# EAGLE design BackscatterPlantSensor_v1 (EAGLE 6.4)

## Sheet 1 of 3
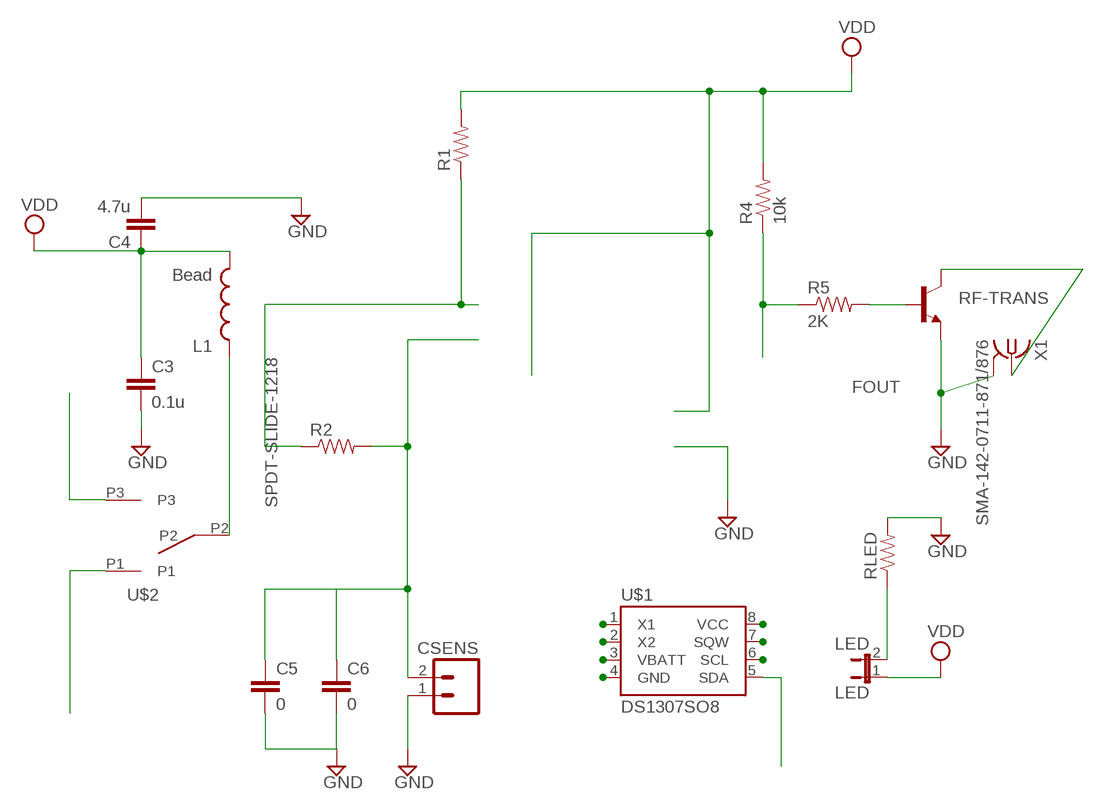
[diagram p0: schematic, sheet 1]

### Parts
C3  0.1u  CAP0603-CAP  [0603-CAP]
C4  4.7u  CAP0805  [0805]
C5  0  CAP0603-CAP  [0603-CAP]
C6  0  CAP0603-CAP  [0603-CAP]
CSENS  M02PTH  [1X02]
L1  Bead  INDUCTOR0402  [C0402]
LED  LED  JUMPER-2PTH_LOCK  [1X02_LOCK]
R1  RESISTOR0805-RES  [0805]
R2  RESISTOR0603-RES  [0603-RES]
R4  10k  RESISTOR0805-RES  [0805]
R5  2K  RESISTOR0805-RES  [0805]
RF-TRANS  TRANSISTOR_NPNSOT23  [SOT23]
RLED  RESISTOR0805-RES  [0805]
U$1  DS1307SO8  [SO08]
U$2  SPDT-SLIDE-1218  [SPDT-SLIDE-1218]
X1  SMA-142-0711-871/876  [J502-ND-142-0711-871/876]

### Nets
DGND: C3.2 C4.2 C5.2 C6.2 CSENS.1 RF-TRANS.2(E) RLED.2 U$1.1(X1) X1.G@1(GND) ; supply symbol labelled GND
FOUT: R4.1 R5.1 U$1.3(VBATT)
N$4: LED.2 RLED.1
N$5: RF-TRANS.3(C) X1.1
N$7: U$2.P3
N$9: R5.2 RF-TRANS.1(B)
P2: C5.1 C6.1 CSENS.2 R2.2 U$1.2(X2) U$1.6(SCL)
P5: U$1.5(SDA) ; also sheet 2
P7: R1.1 R2.1 U$1.7(SQW)
POWER: U$2.P1 ; also sheet 2
POWEROUT: L1.1 U$2.P2 ; also sheet 2
VDD: C3.1 C4.1 L1.2 LED.1 R1.2 R4.2 U$1.4(GND) U$1.8(VCC)

## Sheet 2 of 3
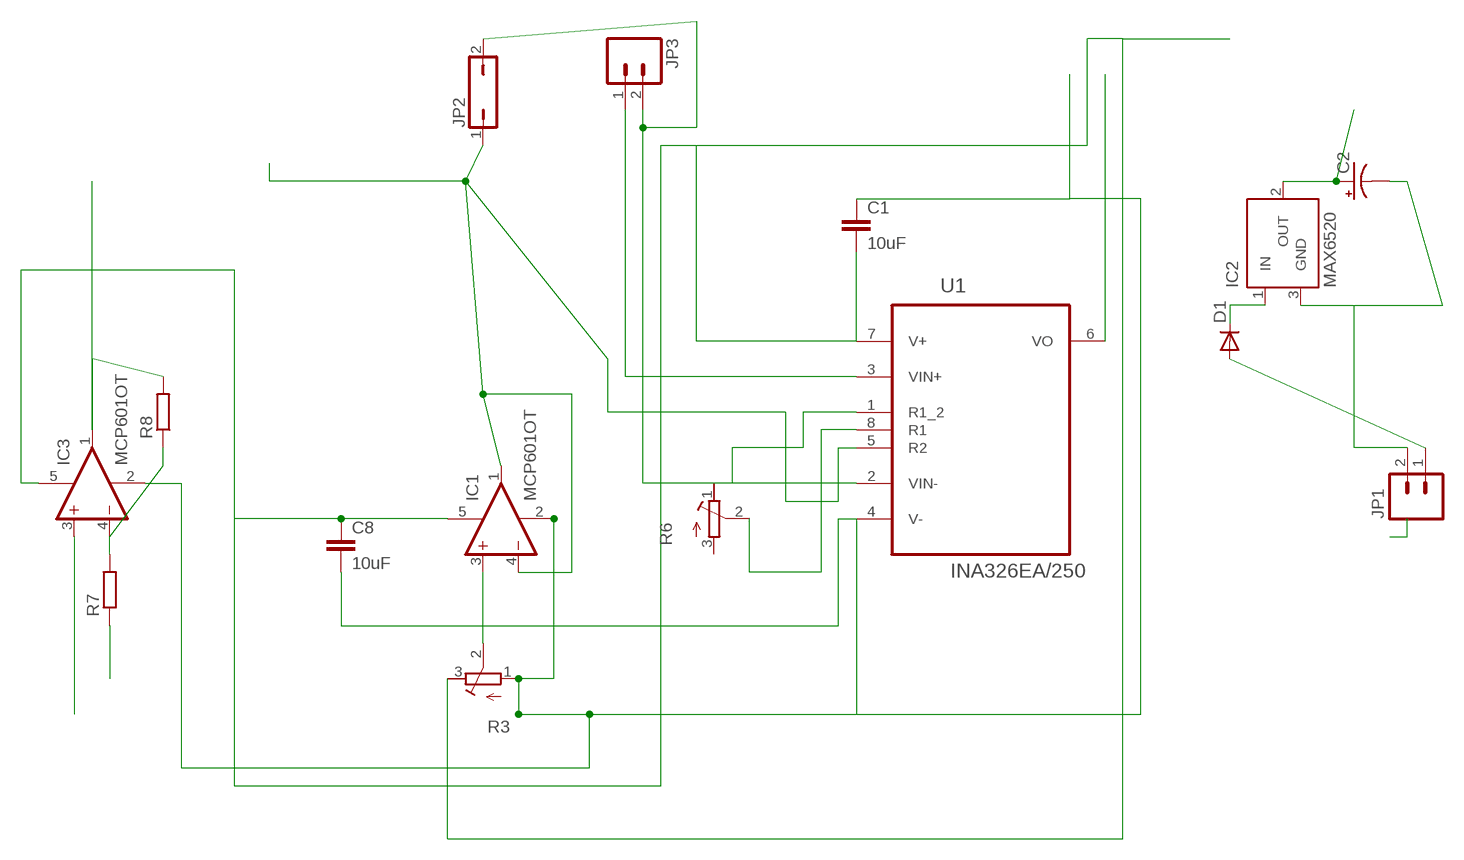
[diagram p1: schematic, sheet 2]

### Parts
C1  10uF  CAP0805  [0805]
C2  CAP_POLPTH1  [CPOL-RADIAL-100UF-25V]
C8  10uF  CAP0805  [0805]
D1  DIODESOD523  [SOD523]
IC1  MCP601OT  [SOT23-5]
IC2  MAX6520  [SOT23]
IC3  MCP601OT  [SOT23-5]
JP1  M02PTH  [1X02]
JP2  JP1Q  [JP1]
JP3  M02PTH  [1X02]
R3  R-TRIMM3314J  [RTRIM3314J]
R6  R-TRIMM3314G  [RTRIM3314G]
R7  R-EU_R0603  [R0603]
R8  R-EU_R0603  [R0603]
U1  INA326EA/250  [SOP65P490X110-8N]

### Nets
AGND: C1.1 C8.2 IC1.2(V-) IC3.2(V-) R3.1(E) R7.1 U1.4(V-)
GND: C2.2(-) IC2.3(GND) JP1.2
IN: D1.C IC2.1(IN)
N$10: IC1.3(+IN) R3.2(S)
N$20: JP2.2 JP3.2 U1.2(VIN-)
N$21: JP3.1 U1.3(VIN+)
N$23: R6.2(S) U1.8(R1)
N$49: R6.1(E) U1.1(R1_2)
N$58: D1.A JP1.1
N$99: IC3.4(-IN) R7.2 R8.1
P5: IC3.1(OUT) R8.2 ; also sheet 1
POWER: C2.1(+) IC2.2(OUT) ; also sheet 1
POWEROUT: C1.2 C8.1 IC1.5(V+) IC3.5(V+) R3.3(A) U1.7(V+) ; also sheet 1
VOUT1: IC3.3(+IN) U1.6(VO)
VREF: IC1.1(OUT) IC1.4(-IN) JP2.1 U1.5(R2)
Unconnected: R6.3(A)

## Sheet 3 of 3

## Power pins joined to a net without a drawn wire
DGND: X1.G@2(GND) X1.G@3(GND) X1.G@4(GND)

## Library data of the parts
C1 C8 = SparkFun-Passives:CAP: Capacitor Standard 0603 ceramic capacitor, and 0.1" leaded capacitor.
C2 = SparkFun:CAP_POL: Capacitor Polarized These are standard SMD and PTH capacitors. Normally 10uF, 47uF, and 100uF in electrolytic and tantalum varieties. Always verify the external diameter of the through hole cap, it varies with capacity, voltage, and manufacturer. The EIA devices should be standard.
C3-C6 = SparkFun-Capacitors:CAP: Capacitor Standard 0603 ceramic capacitor, and 0.1" leaded capacitor.
CSENS = SparkFun:M02: Header 2 Standard 2-pin 0.1" header. Use with straight break away headers (SKU : PRT-00116), right angle break away headers (PRT-00553), swiss pins (PRT-00743), machine pins (PRT-00117), and female headers (PRT-00115). Molex polarized connector foot print use with SKU : PRT-08233 with associated crimp pins and housings.
D1 = SparkFun-DiscreteSemi:DIODE: Diode These are standard reverse protection diodes and small signal diodes. SMA package can handle up to about 1A. SOD-323 can handle about 200mA. What the SOD-323 package when ordering, there are some mfgs out there that are 5-pin packages.
IC1 IC3 = linear:MCP601: Single Op Amp 2.7V to 6.0V Single Supply CMOS Source: http://ww1.microchip.com/downloads/en/DeviceDoc/21314g.pdf
IC2 = maxim:MAX6520: 1.2V Voltage Reference 50ppm/°C, SOT23, 3-Terminal Source: Data sheet <http://datasheets.maxim-ic.com/en/ds/MAX6520.pdf>; MF: MAXIM; MPN: MAX6520EUR-T; OC_FARNELL: unknown; OC_NEWARK: 02J4586
JP1 JP3 = SparkFun-Connectors:M02: Header 2 Standard 2-pin 0.1" header. Use with straight break away headers (SKU : PRT-00116), right angle break away headers (PRT-00553), swiss pins (PRT-00743), machine pins (PRT-00117), and female headers (PRT-00115). Molex polarized connector foot print use with SKU : PRT-08233 with associated crimp pins and housings.
JP2 = jumper:JP1Q: JUMPER
L1 = SparkFun-Passives:INDUCTOR: Inductors Basic Inductor/Choke - 0603 and 1206. Footprints are not proven and vary greatly between part numbers.
LED = SparkFun-Passives:JUMPER-2: Jumper Basic 0.1" spaced jumper. Use with breakaway headers.
R1 R2 R4 R5 RLED = SparkFun-Resistors:RESISTOR: Resistor Basic schematic elements and footprints for 0603, 1206, and PTH resistors.
R3 = resistor:R-TRIMM: Trimm resistor
R6 = rcl:R-TRIMM: Trimm resistor
R7 R8 = resistor:R-EU_: RESISTOR, European symbol
RF-TRANS = SparkFun-DiscreteSemi:TRANSISTOR_NPN: Generic NPN BJT. MMBT2222 is the common NPN we use. Double check against datasheet- not all devices are the same!
U1 = Texas Instruments_By_element14_Batch_1:INA326EA/250: Precision, Rail-to-Rail I/O INSTRUMENTATION AMPLIFIER; MPN: INA326EA/250; OC_FARNELL: 1218192; OC_NEWARK: 74K3817; PACKAGE: MSOP-8; SUPPLIER: Texas Instruments
U$1 = SparkFun-FreqCtrl:DS1307: I2C real-time clock with battery backup.
U$2 = iCube_library:SPDT-SLIDE-1218
X1 = con-coax:SMA-: SMA 50 Ohm End Launch Jack Receptacle - Round Contact Johnson Components Source: www.johnsoncomponents.com .. J502-ND.pdf; MF: JOHNSON COMPONENTS; MPN: 142-0711-871; OC_FARNELL: unknown; OC_NEWARK: 01C1639

## Board
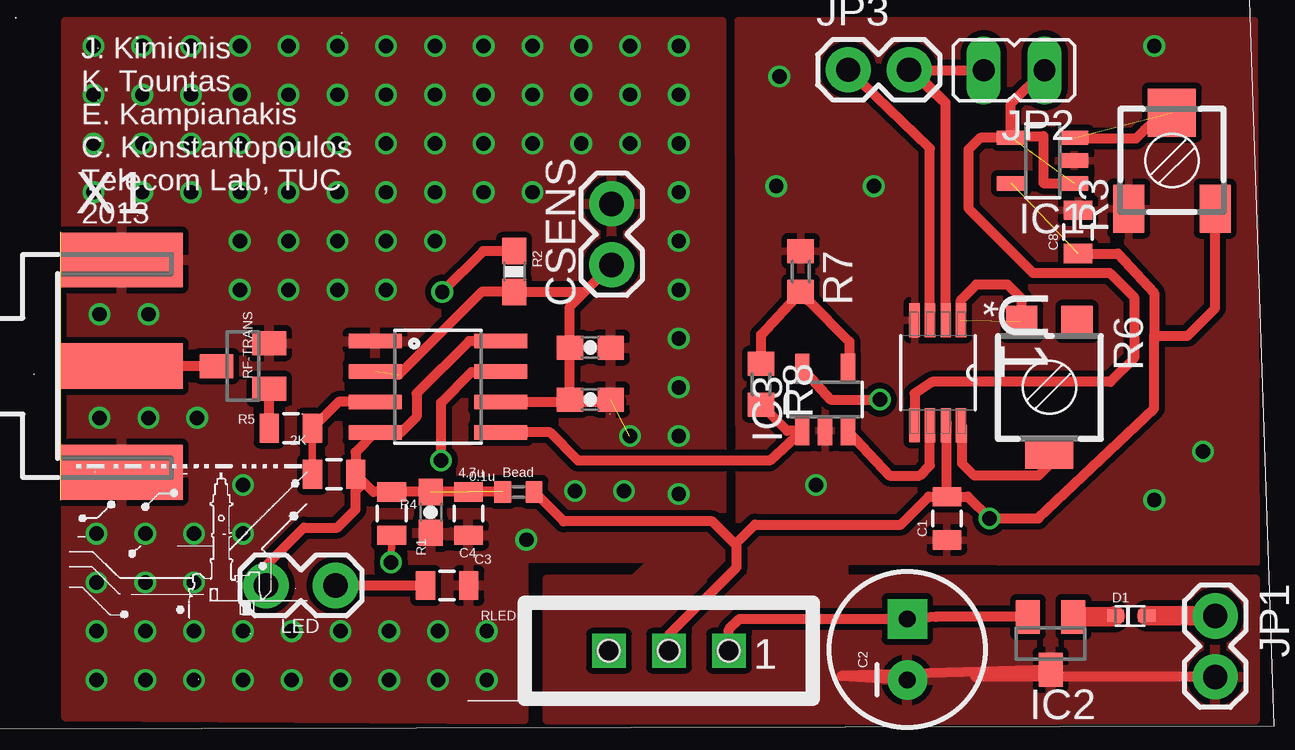
[diagram p2: board, top side]
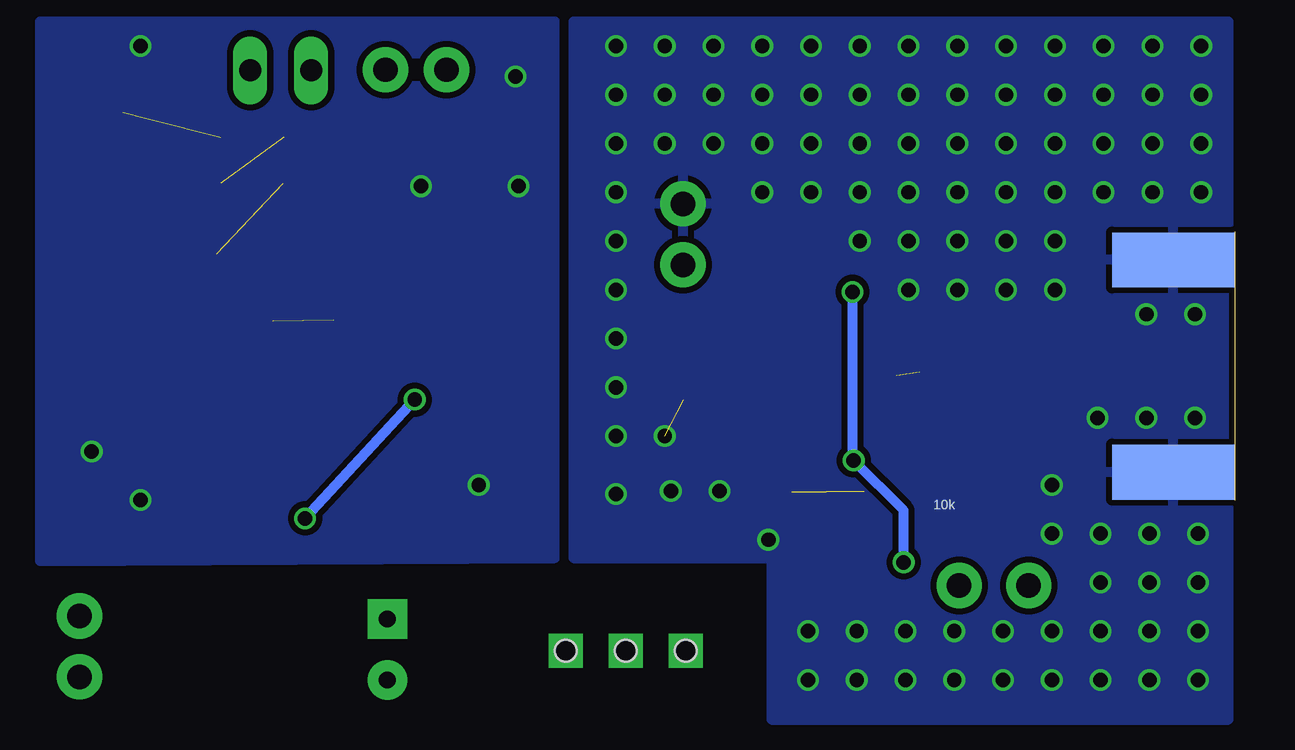
[diagram p3: board, bottom side, seen from below]

Size 0 x 11.18 mm. Coordinates in mm from the lower left corner, seen from the top.
Copper layers (1*16): Top 0.035mm / dielectric 1.5mm / Bottom 0.035mm
Design rules "Fusion_eagle_rule_v1.1 *": minimum track width 6mil, minimum drill 12mil, track to track 10mil, track to pad 10mil, pad to pad 10mil, via to via 10mil, smd to smd 0mil, copper to edge 10mil, drill to drill 10mil, minimum pad ring 10mil, minimum via ring 6mil, stop-mask expansion 2mil, vias tented up to drill 100mil, thermal gap 10mil

### Footprints (pad centres in the part's own frame; a part is rotated, then mirrored left to right if it is on the bottom)
0805 = smd 0.8 x 1.2: 1 -0.9,0; 2 0.9,0
CPOL-RADIAL-100UF-25V = drill 0.7 pad 1.651 square: 1 1.27,0 | drill 0.7 pad 1.651: 2 -1.27,0
0603-CAP = smd 1.1 x 1: 1 -0.85,0; 2 0.85,0
1X02 = drill 1.016 pad 1.88: 1 0,0; 2 2.54,0
SOD523 = smd 0.7 x 0.5: A 0.7,0; C -0.6,0
SOT23-5 = smd 0.6 x 1.2: 1 -0.95,-1.306; 2 0,-1.306; 3 0.95,-1.306; 4 0.95,1.306; 5 -0.95,1.306
SOT23 = smd 1 x 1.4: 1 -0.95,-1.1; 2 0.95,-1.1; 3 0,1.1
JP1 = drill 0.914 long: 1 0,-1.27; 2 0,1.27
C0402 = smd 0.7 x 0.9: 1 -0.65,0; 2 0.65,0
1X02_LOCK = drill 1.016 pad 1.88: 1 -0.178,0; 2 2.718,0
0603-RES = smd 1.1 x 1: 1 -0.85,0; 2 0.85,0
RTRIM3314J = smd 1.3 x 2: 1 -1.8,-2; 3 1.8,-2 | smd 2 x 2: 2 0,2
RTRIM3314G = smd 1.3 x 1.3: 1 1.15,-2.75; 3 -1.15,-2.75 | smd 2 x 1.3: 2 0,2.75
R0603 = smd 1 x 1.1: 1 -0.85,0; 2 0.85,0
SOP65P490X110-8N = smd 1.422 x 0.432: 1 -2.184,0.965; 2 -2.184,0.33; 3 -2.184,-0.33; 4 -2.184,-0.965; 5 2.184,-0.965; 6 2.184,-0.33; 7 2.184,0.33; 8 2.184,0.965
SO08 = smd 0.61 x 2.21: 1 -1.905,-2.616; 2 -0.635,-2.616; 3 0.635,-2.616; 4 1.905,-2.616; 5 1.905,2.616; 6 0.635,2.616; 7 -0.635,2.616; 8 -1.905,2.616
SPDT-SLIDE-1218 = drill 0.9 square: P1 -2.5,0; P2 0,0; P3 2.5,0 | hole 0.9: -2.5,0; 0,0; 2.5,0
J502-ND-142-0711-871/876 = smd 5.08 x 1.905: 1 2.565,0 | smd 5.08 x 2.286: G@1 2.565,4.42; G@2 2.565,-4.42 | smd 5.08 x 2.286 bottom: G@3 2.565,4.42; G@4 2.565,-4.42

### Placement (x,y rotation side)
C1  36.96,-0.76 90 top  (outside the outline)
C2  35.31,-6.22 90 top  (outside the outline)
C3  15.44,-0.51 270 top  (outside the outline)
C4  17.02,-0.56 270 top  (outside the outline)
C5  22.1,6.35 0 top  (outside the outline)
C6  22.1,4.19 0 top  (outside the outline)
C8  42.42,11.18 90 top  (outside the outline)
CSENS  22.99,12.34 270 top  (outside the outline)
D1  44.58,-4.83 0 top  (outside the outline)
IC1  40.94,14.15 90 top  (outside the outline)
IC2  41.27,-5.97 180 top  (outside the outline)
IC3  31.88,4.19 0 top  (outside the outline)
JP1  48.13,-4.83 270 top  (outside the outline)
JP2  39.75,17.91 90 top  (outside the outline)
JP3  32.84,17.93 0 top  (outside the outline)
L1  19.1,0.34 180 top  (outside the outline)
LED  8.76,-3.56 0 top  (outside the outline)
R1  13.82,-0.56 90 top  (outside the outline)
R2  18.92,9.52 270 top  (outside the outline)
R3  46.33,14.15 0 top  (outside the outline)
R4  11.42,1.08 0 top  (outside the outline)
R5  9.62,3 180 top  (outside the outline)
R6  41.22,4.7 180 top  (outside the outline)
R7  30.86,9.52 270 top  (outside the outline)
R8  29.21,4.83 270 top  (outside the outline)
RF-TRANS  7.62,5.59 90 top  (outside the outline)
RLED  16.13,-3.56 0 top  (outside the outline)
U1  36.58,5.31 270 top  (outside the outline)
U$1  15.75,4.72 270 top  (outside the outline)
U$2  25.37,-6.27 180 top  (outside the outline)
X1  0,5.59 0 top

### Tracks (layer width: path | path; a pad name or v marks a point on that pad's centre or on a via)
AGND  (via drill 0.6)
  other vias: 29.84,13.08 29.97,17.65 45.59,18.92 47.62,2.03 45.59,0 31.5,0.63 33.91,13.08
  pour Top: 28.27,19.96 49.76,19.96 49.83,-2.59 28.3,-2.54
  pour Bottom: 28.32,19.94 49.78,19.94 49.78,-2.54 28.32,-2.41
DGND  (via drill 0.6)  (1 unrouted)
  other vias: 1.52,-7.49 3.56,-7.49 5.59,-7.49 7.62,-7.49 9.65,-7.49 11.68,-7.49 13.72,-7.49 15.75,-7.49 17.78,-7.49 25.78,8.76 3.43,18.92 5.46,18.92 7.49,18.92 9.52,18.92 11.56,18.92 13.59,18.92 15.62,18.92 17.65,18.92 19.69,18.92 21.72,18.92 13.59,16.89 15.62,16.89 13.59,8.76 13.59,10.79 15.62,12.83 17.65,12.83 17.65,16.89 13.59,14.86 3.43,16.89 5.46,16.89 7.49,16.89 9.52,16.89 11.56,16.89 1.4,14.86 3.43,14.86 5.46,14.86 7.49,14.86 9.52,14.86 11.56,14.86 7.49,12.83 9.52,12.83 11.56,12.83 9.52,10.79 11.56,10.79 9.52,8.76 11.56,8.76 23.75,18.92 23.75,16.89 19.69,16.89 19.69,14.86 21.72,16.89 25.78,18.92 25.78,16.89 23.75,14.86 21.72,14.86 25.78,14.86 25.78,12.83 25.78,10.79 23.75,2.67 25.78,2.67 21.46,0.38 19.43,-1.65 7.62,0.63 1.52,-1.4 5.59,-1.4 7.62,-1.4 17.78,-5.46 1.52,-3.43 3.56,-3.43 5.59,-3.43 1.52,-5.46 3.56,-5.46 5.59,-5.46 7.62,-5.46 9.65,-5.46 11.68,-5.46 13.72,-5.46 15.75,-5.46 1.4,18.92 1.4,16.89 1.65,3.43 3.56,-1.4 3.68,3.43 1.65,7.75 3.68,7.75 5.46,12.83 3.43,12.83 1.4,12.83 7.49,10.79 7.49,8.76 5.71,3.43 19.69,12.83 15.62,14.86 17.65,14.86 13.59,12.83 15.62,10.79 25.78,6.73 25.78,4.7 23.5,0.38 25.78,0.25
  pour Top: 0.25,19.94 27.56,19.94 27.56,-2.41 19.3,-2.41 19.3,-9.14 0.25,-9.02
  pour Bottom: 0.25,19.94 27.56,19.94 27.56,-2.41 19.3,-2.41 19.3,-9.14 0.25,-9.14
FOUT
  Top 0.305: R4.1 R5.1
  Top 0.406: U$1.3 11.61,4.09 R5.1
GND
  Top 0.406: JP1.2 38.14,-7.37 IC2.3 32.55,-7.32 C2.2
  pour Top: 20.32,-3.3 49.78,-3.3 49.78,-9.14 20.32,-9.14
IN
  Top 0.813: IC2.1 43.93,-4.87 D1.C
N$4
  Top 0.406: LED.2 RLED.1
N$5
  Top 0.406: RF-TRANS.3 X1.1
N$6
  pour Top: 25.53,-4.45 22.86,-4.32 25.15,-2.16 27.56,-2.41
N$8
  pour Top: 28.83,-2.16 32.64,-2.16 32.64,-3.3 28.83,-3.3
N$9
  Top 0.406: R5.2 RF-TRANS.1
N$10  (1 unrouted)
N$20
  Top 0.406: U1.2 36.91,16.54 | 36.91,16.54 JP3.2 | 36.91,16.54 36.91,16.56 35.56,17.91 JP2.2
N$21
  Top 0.406: U1.3 36.25,14.66 JP3.1
N$23
  Top 0.406: R6.2 41.22,1.47 40.77,1.02 38.1,1.02 37.59,1.52 37.59,3.07 U1.8
N$49  (1 unrouted)
N$52
  Top 0.305: 40.01,7.98 40.08,7.9
N$53
  Top 0.305: 40.79,2.34 40.84,2.39
N$57  (via drill 0.6)
  other vias: 34.16,4.19
N$58
  Top 0.813: D1.A JP1.1
N$84  (via drill 0.6)
  other vias: 15.88,1.65
N$94
  Top 0.406: 46.13,16.38 46.13,16.2 45.16,15.39 44.83,15.06 42.32,15.06
N$95
  Top 0.406: 39.85,15.16 40.97,15.16 40.97,13.21 42.22,13.21
N$97
  Top 0.406: 37.54,7.39 37.54,8.33 38.2,8.99
N$98
  Top 0.406: 38.18,8.99 39.47,8.99 40.06,8.41 40.06,7.54 40.03,7.52
N$99
  Top 0.406: R8.1 29.21,6.9 R7.2 31.12,8.34 31.15,8.34 32.89,6.6 32.89,5.56 IC3.4
P2  (1 unrouted)
  Top 0.406: C6.1 23.15,4.1 | 14.1,5.21 17.57,8.68 R2.2 21.86,8.68 | 21.86,8.68 21.96,8.78 CSENS.2 | U$1.6 22.49,4.09 C6.1 | C6.1 C5.1 21.25,8.06 21.86,8.68
P5
  Top 0.406: U$1.5 20.42,2.82 21.59,1.65 29.57,1.65 IC3.1 30.3,2.88 R8.2
P7  (via drill 0.6, 0.6 pad 0.3)
  Top 0.305: R1.1 v13.79,-2.59
  Top 0.406: R2.1 17.63,10.38 v15.93,8.67 | v15.88,1.65 15.88,4.06 17.14,5.33 18.34,5.33 U$1.7
  Bottom 0.406: v13.79,-2.59 13.79,-0.43 v15.88,1.65 15.93,1.7 v15.93,8.67
POWER
  Top 0.406: IC2.2 36.49,-4.87 C2.1 28.31,-4.95 27.88,-5.39 U$2.P1
POWEROUT  (via drill 0.6)  (1 unrouted)
  Top 0.406: U$2.P2 25.38,-5.61 28.19,-2.79 28.19,-1.91 | 28.19,-1.91 27.18,-0.89 20.98,-0.89 L1.1 | 28.19,-1.91 28.19,-1.78 28.96,-1.02 35.04,-1.02 36.2,0.14 C1.2 | C1.2 36.96,3.2 U1.7 | C1.2 37.83,0.14 v38.73,-0.76 40.77,-0.76 45.59,3.81 45.59,6.86 | R3.3 48.13,8 46.99,6.86 45.59,6.86 | C8.1 44.08,10.27 45.59,8.64 45.59,6.86 | IC3.5 32.11,4.19 v34.16,4.19
  Bottom 0.406: v34.16,4.19 v38.73,-0.76
VDD  (2 unrouted)
  Top 0.152: 14.2,2.9 14.23,2.85 U$1.4
  Top 0.406: U$1.8 17.04,6.63 14.86,4.44 14.86,3.48 14.23,2.85 | U$1.4 12.32,2 R4.2 12.67,0.73 | L1.2 R1.2 13.06,0.34 12.67,0.73 | LED.1 8.59,-2.72 10.16,-1.14 11.56,-1.14 12.32,-0.38 12.32,0.38 12.67,0.73
VOUT1
  Top 0.406: IC3.3 34.57,1.02 35.81,1.02 36.25,1.45 U1.6
VREF  (1 unrouted)
  Top 0.406: U1.5 35.61,4.44 36.35,4.93 43.76,4.93 44.76,5.92 44.76,8.46 43.74,9.47 40.54,9.47 37.85,12.17 37.85,14.6 38.34,15.1 IC1.4 39.62,15.11 39.62,16.51 JP2.1

### Text on the board
tPlace: J. Kimionis / K. Tountas / E. Kampianakis / C. Konstantopoulos / Telecom Lab, TUC / 2013